# EAGLE design encore Main Board v2 (EAGLE 9.6.2)
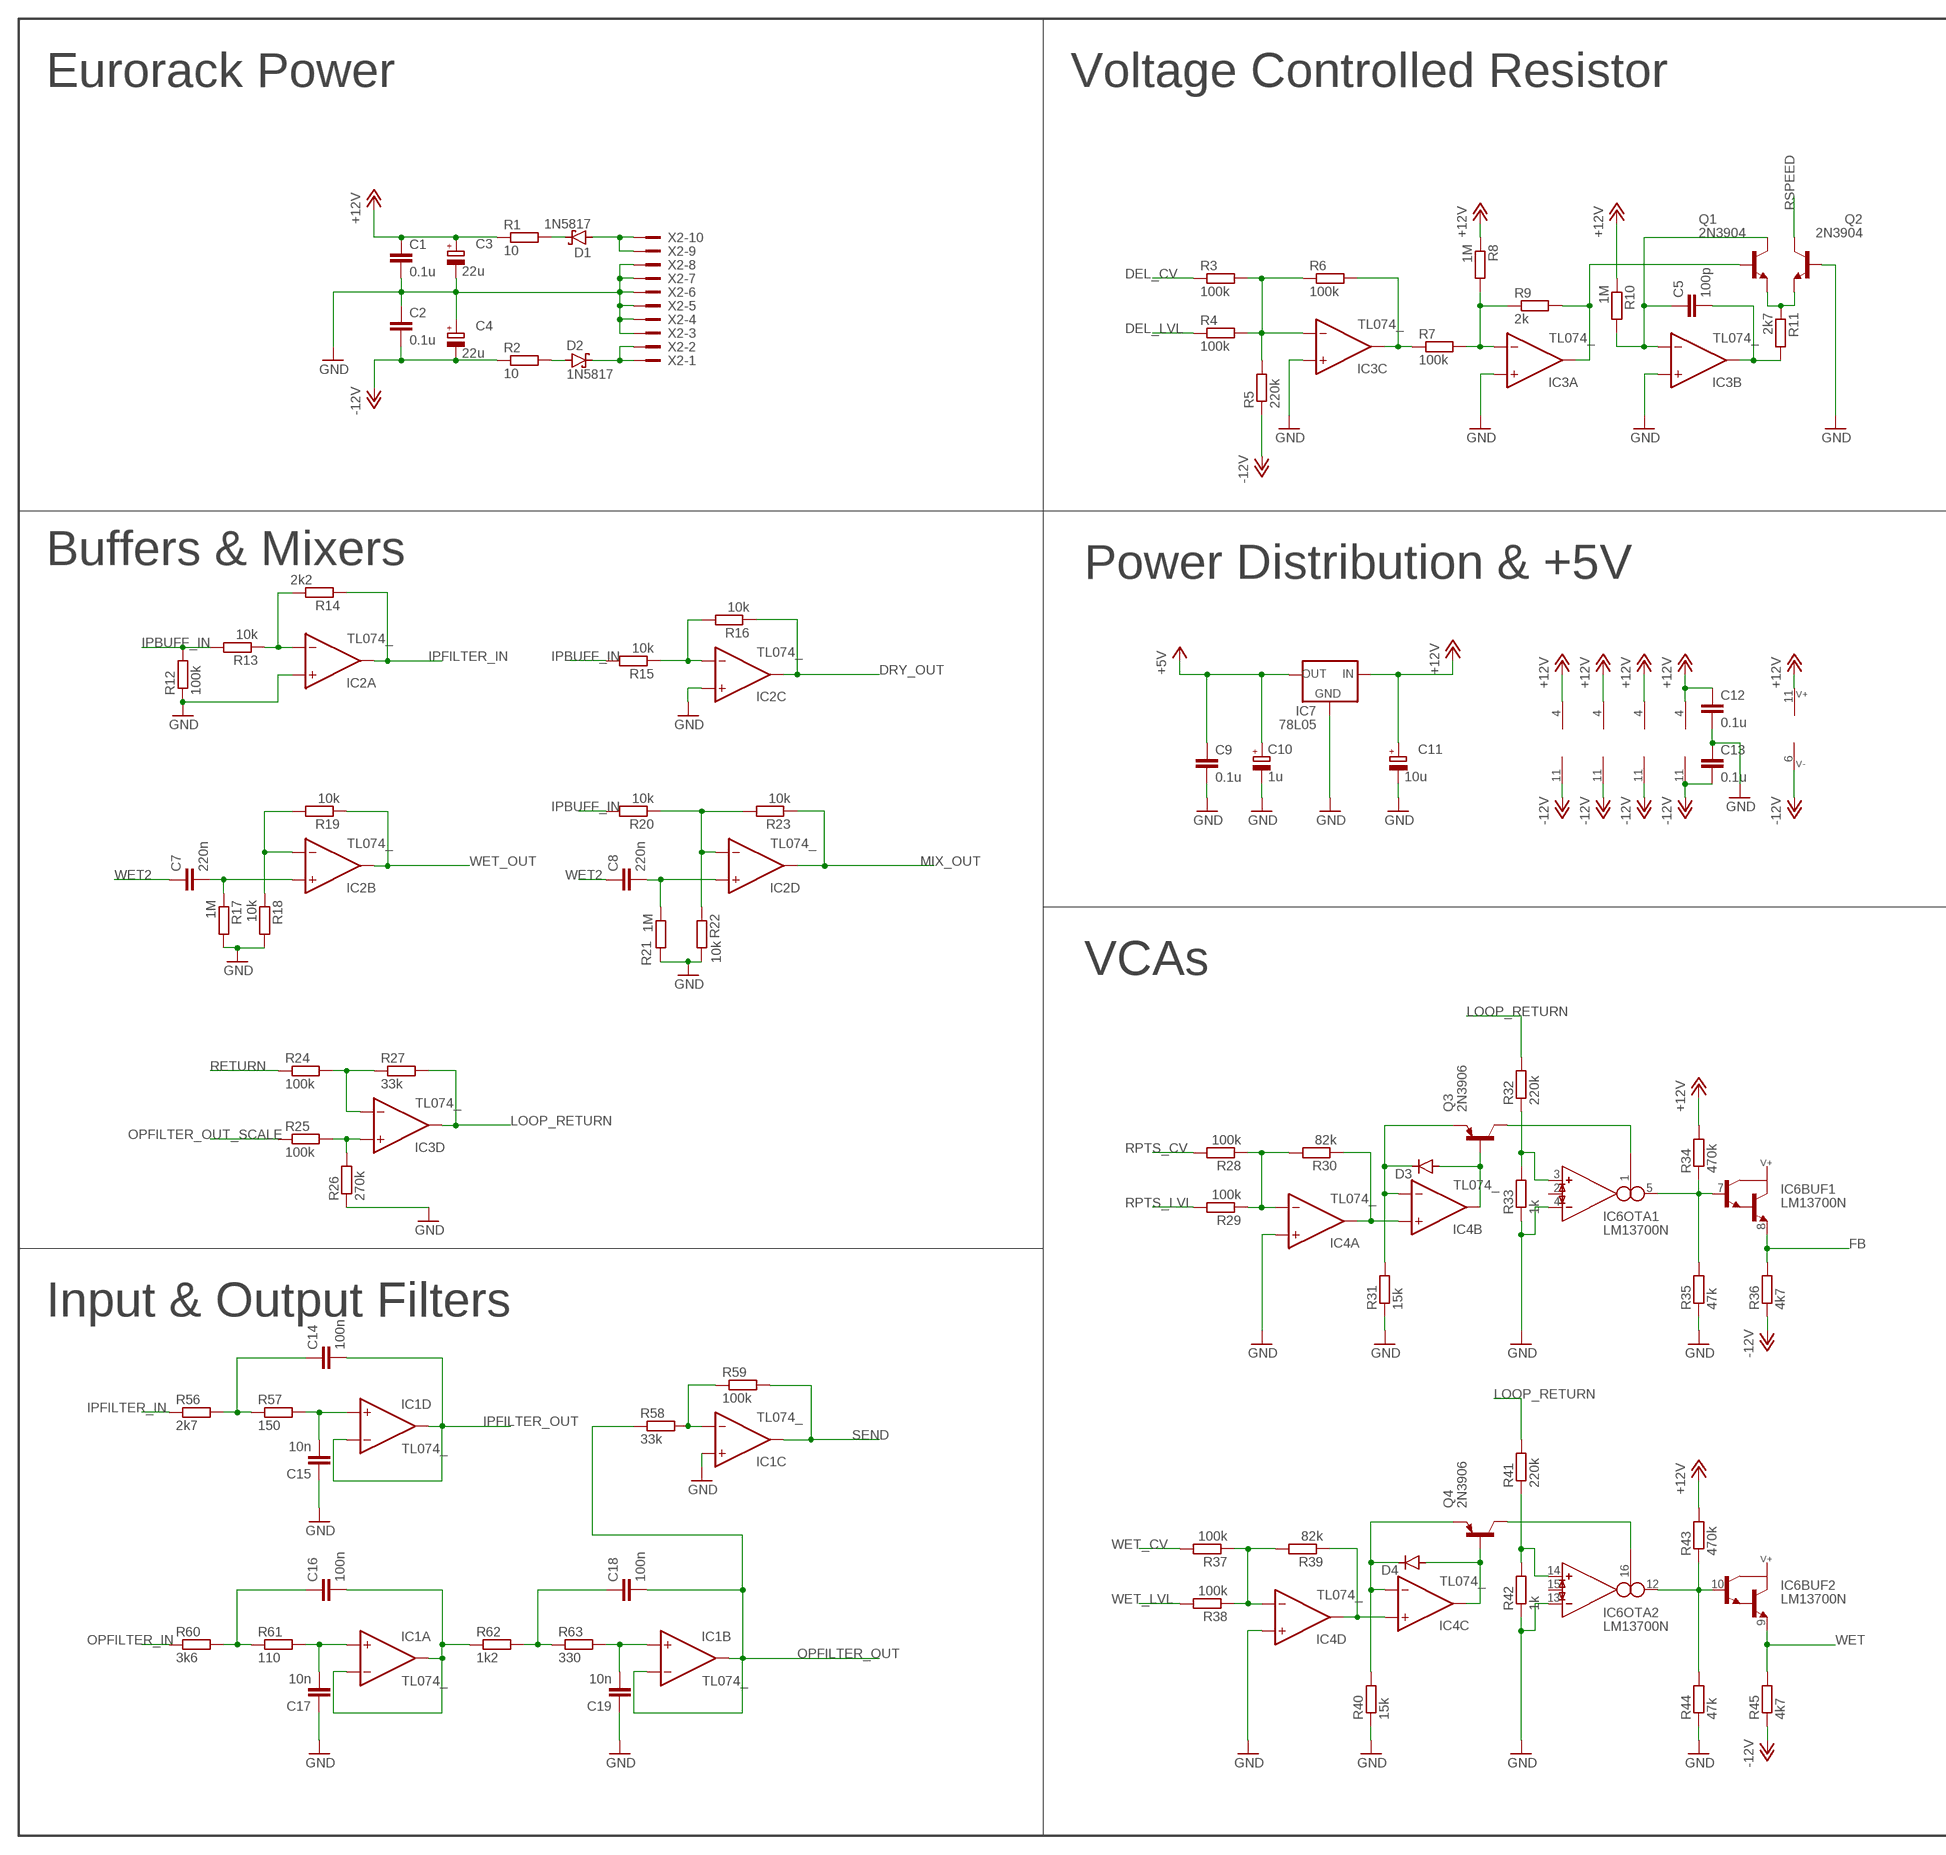
[diagram p0: schematic, sheet 1, part 1 of 2]
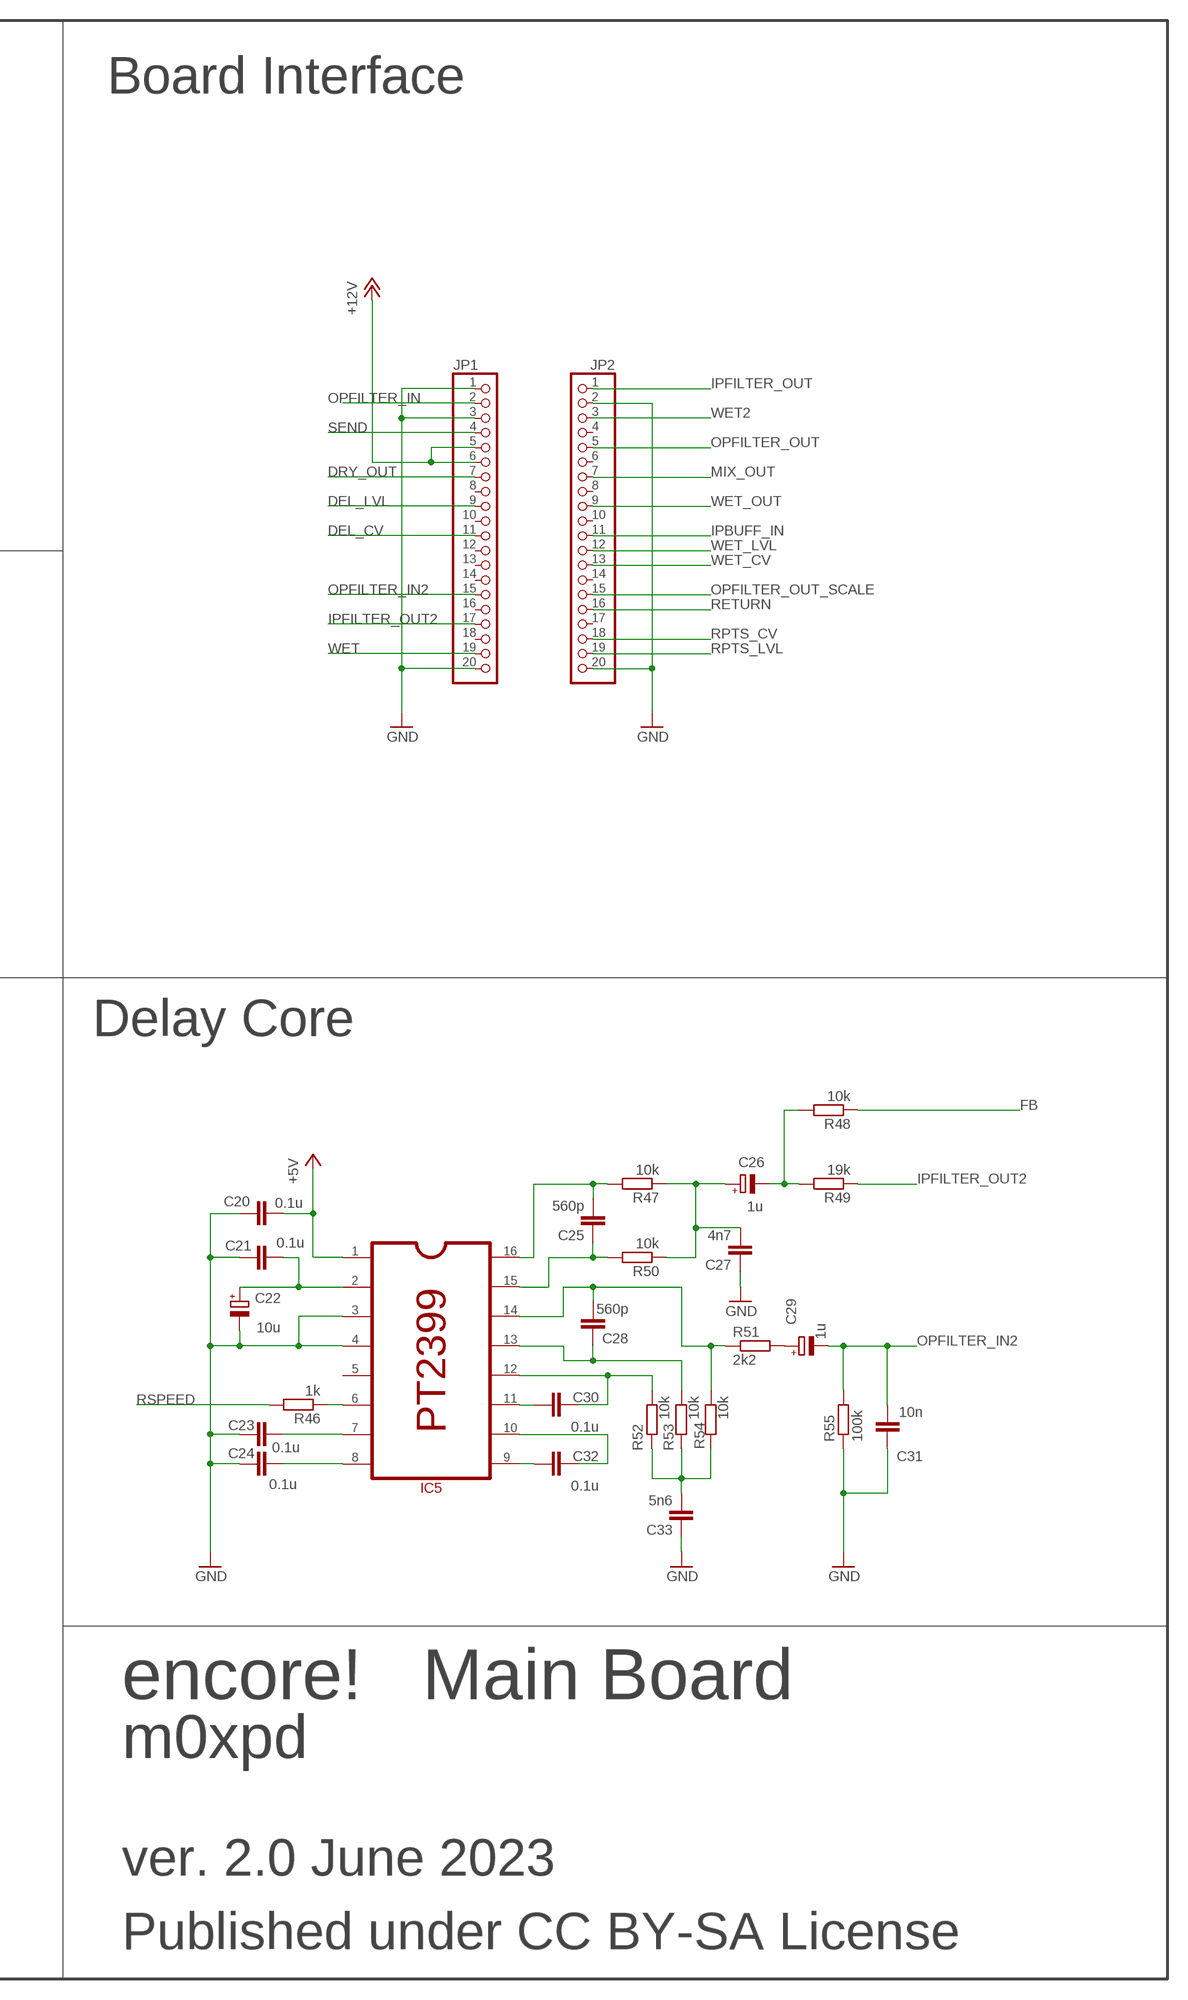
[diagram p1: schematic, sheet 1, part 2 of 2]

## Parts
C1  0.1u  C-EU050-025X075  [C050-025X075]
C2  0.1u  C-EU050-025X075  [C050-025X075]
C3  22u  CPOL-EUE2.5-5  [E2,5-5]
C4  22u  CPOL-EUE2.5-5  [E2,5-5]
C5  100p  C-EU025-025X050  [C025-025X050]
C7  220n  C-EU050-024X044  [C050-024X044]
C8  220n  C-EU050-024X044  [C050-024X044]
C9  0.1u  C-EU050-025X075  [C050-025X075]
C10  1u  CPOL-EUE2.5-5  [E2,5-5]
C11  10u  CPOL-EUE2.5-5  [E2,5-5]
C12  0.1u  C-EU050-025X075  [C050-025X075]
C13  0.1u  C-EU050-025X075  [C050-025X075]
C14  100n  C-EU025-025X050  [C025-025X050]
C15  10n  C-EU025-025X050  [C025-025X050]
C16  100n  C-EU025-025X050  [C025-025X050]
C17  10n  C-EU025-025X050  [C025-025X050]
C18  100n  C-EU025-025X050  [C025-025X050]
C19  10n  C-EU025-025X050  [C025-025X050]
C20  0.1u  C-EU050-025X075  [C050-025X075]
C21  0.1u  C-EU050-025X075  [C050-025X075]
C22  10u  CPOL-EUE2.5-5  [E2,5-5]
C23  0.1u  C-EU050-025X075  [C050-025X075]
C24  0.1u  C-EU050-025X075  [C050-025X075]
C25  560p  C-EU025-025X050  [C025-025X050]
C26  1u  CPOL-EUE2.5-5  [E2,5-5]
C27  4n7  C-EU050-025X075  [C050-025X075]
C28  560p  C-EU025-025X050  [C025-025X050]
C29  1u  CPOL-EUE2.5-5  [E2,5-5]
C30  0.1u  C-EU050-025X075  [C050-025X075]
C31  10n  C-EU025-025X050  [C025-025X050]
C32  0.1u  C-EU050-025X075  [C050-025X075]
C33  5n6  C-EU050-025X075  [C050-025X075]
D1  1N5817  SCHOTTKY-DIODEDO35-7  [DO35-7]
D2  1N5817  SCHOTTKY-DIODEDO35-7  [DO35-7]
D3  1N4148DO35-7  [DO35-7]
D4  1N4148DO35-7  [DO35-7]
IC1  TL074_  [DIL14]
IC2  TL074_  [DIL14]
IC3  TL074_  [DIL14]
IC4  TL074_  [DIL14]
IC5  PT2399  [DIP-16]
IC6  LM13700N  [DIL16]
IC7  78L05  78LXX  [78LXX]
JP1  PINHD-1X20  [1X20]
JP2  PINHD-1X20  [1X20]
Q1  2N3904  [TO92]
Q2  2N3904  [TO92]
Q3  2N3906  [TO92]
Q4  2N3906  [TO92]
R1  10  R-EU_0204/7  [0204/7]
R2  10  R-EU_0204/7  [0204/7]
R3  100k  R-EU_0204/7  [0204/7]
R4  100k  R-EU_0204/7  [0204/7]
R5  220k  R-EU_0204/7  [0204/7]
R6  100k  R-EU_0204/7  [0204/7]
R7  100k  R-EU_0204/7  [0204/7]
R8  1M  R-EU_0204/7  [0204/7]
R9  2k  R-EU_0204/7  [0204/7]
R10  1M  R-EU_0204/7  [0204/7]
R11  2k7  R-EU_0204/7  [0204/7]
R12  100k  R-EU_0204/7  [0204/7]
R13  10k  R-EU_0204/7  [0204/7]
R14  2k2  R-EU_0204/7  [0204/7]
R15  10k  R-EU_0204/7  [0204/7]
R16  10k  R-EU_0204/7  [0204/7]
R17  1M  R-EU_0204/7  [0204/7]
R18  10k  R-EU_0204/7  [0204/7]
R19  10k  R-EU_0204/7  [0204/7]
R20  10k  R-EU_0204/7  [0204/7]
R21  1M  R-EU_0204/7  [0204/7]
R22  10k  R-EU_0204/7  [0204/7]
R23  10k  R-EU_0204/7  [0204/7]
R24  100k  R-EU_0204/7  [0204/7]
R25  100k  R-EU_0204/7  [0204/7]
R26  270k  R-EU_0204/7  [0204/7]
R27  33k  R-EU_0204/7  [0204/7]
R28  100k  R-EU_0204/7  [0204/7]
R29  100k  R-EU_0204/7  [0204/7]
R30  82k  R-EU_0204/7  [0204/7]
R31  15k  R-EU_0204/7  [0204/7]
R32  220k  R-EU_0204/7  [0204/7]
R33  1k  R-EU_0204/7  [0204/7]
R34  470k  R-EU_0204/7  [0204/7]
R35  47k  R-EU_0204/7  [0204/7]
R36  4k7  R-EU_0204/7  [0204/7]
R37  100k  R-EU_0204/7  [0204/7]
R38  100k  R-EU_0204/7  [0204/7]
R39  82k  R-EU_0204/7  [0204/7]
R40  15k  R-EU_0204/7  [0204/7]
R41  220k  R-EU_0204/7  [0204/7]
R42  1k  R-EU_0204/7  [0204/7]
R43  470k  R-EU_0204/7  [0204/7]
R44  47k  R-EU_0204/7  [0204/7]
R45  4k7  R-EU_0204/7  [0204/7]
R46  1k  R-EU_0204/7  [0204/7]
R47  10k  R-EU_0204/7  [0204/7]
R48  10k  R-EU_0204/7  [0204/7]
R49  19k  R-EU_0204/7  [0204/7]
R50  10k  R-EU_0204/7  [0204/7]
R51  2k2  R-EU_0204/7  [0204/7]
R52  10k  R-EU_0204/7  [0204/7]
R53  10k  R-EU_0204/7  [0204/7]
R54  10k  R-EU_0204/7  [0204/7]
R55  100k  R-EU_0204/7  [0204/7]
R56  2k7  R-EU_0204/7  [0204/7]
R57  150  R-EU_0204/7  [0204/7]
R58  33k  R-EU_0204/7  [0204/7]
R59  100k  R-EU_0204/7  [0204/7]
R60  3k6  R-EU_0204/7  [0204/7]
R61  110  R-EU_0204/7  [0204/7]
R62  1k2  R-EU_0204/7  [0204/7]
R63  330  R-EU_0204/7  [0204/7]
X2  2510-  [PAK100/2500-10]

## Nets
+5V: C9.1 C10.+ C20.2 IC5.1 IC7.OUT
+12V: C1.1 C3.+ C11.+ C12.1 IC1.4(P:V+) IC2.4(P:V+) IC3.4(P:V+) IC4.4(P:V+) IC6.11(SUPPLY:V+) IC7.IN JP1.5 JP1.6 R1.1 R8.1 R10.1 R34.2 R43.2
-12V: C2.2 C4.- C13.2 IC1.11(P:V-) IC2.11(P:V-) IC3.11(P:V-) IC4.11(P:V-) IC6.6(SUPPLY:V-) R2.1 R5.1 R36.1 R45.1
DEL_CV: JP1.11 R3.1
DEL_LVL: JP1.9 R4.1
DRY_OUT: IC2.8(C:OUT) JP1.7 R16.1
FB: IC6.8(BUF1:E) R36.2 R48.1
GND: C1.2 C2.1 C3.- C4.+ C9.2 C10.- C11.- C12.2 C13.1 C15.1 C17.1 C19.1 C20.1 C21.1 C22.- C23.1 C24.1 C27.1 C31.1 C33.1 IC1.10(C:+IN) IC2.3(A:+IN) IC2.10(C:+IN) IC3.3(A:+IN) IC3.5(B:+IN) IC3.10(C:+IN) IC4.3(A:+IN) IC4.12(D:+IN) IC5.3 IC5.4 IC6.4(OTA1:IN_N) IC6.13(OTA2:IN_N) IC7.GND JP1.1 JP1.3 JP1.20 JP2.2 JP2.20 Q2.2(B) R12.1 R17.2 R18.2 R21.2 R22.2 R26.1 R31.1 R33.1 R35.1 R40.1 R42.1 R44.1 R55.1 X2.3 X2.4 X2.5 X2.6 X2.7 X2.8
IPBUFF_IN: JP2.11 R12.2 R13.2 R15.2 R20.2
IPFILTER_IN: IC2.1(A:OUT) R14.1 R56.1
IPFILTER_OUT: C14.2 IC1.13(D:-IN) IC1.14(D:OUT) JP2.1
IPFILTER_OUT2: JP1.17 R49.1
LOOP_RETURN: IC3.14(D:OUT) R27.2 R32.2 R41.2
MIX_OUT: IC2.14(D:OUT) JP2.7 R23.1
N$1: IC3.1(A:OUT) Q1.2(B) R9.2
N$2: C15.2 IC1.12(D:+IN) R57.2
N$3: C5.1 IC3.6(B:-IN) Q1.1(C) R10.2
N$4: C14.1 R56.2 R57.1
N$5: C16.2 IC1.1(A:OUT) IC1.2(A:-IN) R62.1
N$6: C16.1 R60.2 R61.1
N$7: C17.2 IC1.3(A:+IN) R61.2
N$8: C5.2 IC3.7(B:OUT) R11.2
N$9: Q1.3(E) Q2.3(E) R11.1
N$10: C18.1 R62.2 R63.1
N$11: C19.2 IC1.5(B:+IN) R63.2
N$12: IC2.2(A:-IN) R13.1 R14.2
N$13: D1.A X2.9 X2.10
N$14: D1.C R1.2
N$15: C26.- R48.2 R49.2
N$17: IC2.6(B:-IN) R18.1 R19.2
N$18: C21.2 C22.+ IC5.2
N$19: IC1.9(C:-IN) R58.2 R59.1
N$20: IC6.5(OTA1:OUT) IC6.7(BUF1:B) R34.1 R35.2
N$21: C7.2 IC2.5(B:+IN) R17.1
N$22: IC3.12(D:+IN) R25.2 R26.2
N$23: C32.2 IC5.10
N$24: IC6.3(OTA1:IN_P) R32.1 R33.2
N$25: D3.A IC4.7(B:OUT) Q3.2(B)
N$26: D3.C IC4.6(B:-IN) Q3.3(E) R31.2
N$27: D2.A R2.2
N$28: D2.C X2.1 X2.2
N$29: IC6.1(OTA1:I_BIAS) Q3.1(C)
N$30: IC4.1(A:OUT) IC4.5(B:+IN) R30.1
N$31: IC5.6 R46.1
N$33: IC4.2(A:-IN) R28.1 R29.1 R30.2
N$35: IC4.10(C:+IN) IC4.14(D:OUT) R39.1
N$36: IC6.10(BUF2:B) IC6.12(OTA2:OUT) R43.1 R44.2
N$38: IC6.16(OTA2:I_BIAS) Q4.1(C)
N$39: IC6.14(OTA2:IN_P) R41.1 R42.2
N$40: D4.C IC4.9(C:-IN) Q4.3(E) R40.2
N$41: D4.A IC4.8(C:OUT) Q4.2(B)
N$42: IC3.2(A:-IN) R7.2 R8.2 R9.1
N$43: IC4.13(D:-IN) R37.1 R38.1 R39.2
N$46: IC3.8(C:OUT) R6.2 R7.1
N$47: C23.2 IC5.7
N$48: IC3.9(C:-IN) R3.2 R4.2 R5.2 R6.1
N$49: C24.2 IC5.8
N$50: C25.2 IC5.16 R47.2
N$52: C25.1 IC5.15 R50.2
N$53: C26.+ C27.2 R47.1 R50.1
N$54: C32.1 IC5.9
N$55: C28.2 IC5.14 R51.1 R54.1
N$56: C28.1 IC5.13 R53.1
N$57: C30.1 IC5.11
N$58: C30.2 IC5.12 R52.1
N$59: C33.2 R52.2 R53.2 R54.2
N$60: C29.+ R51.2
N$61: C8.2 IC2.12(D:+IN) R21.1
N$62: IC2.13(D:-IN) R20.1 R22.1 R23.2
N$65: IC3.13(D:-IN) R24.2 R27.1
N$66: IC2.9(C:-IN) R15.1 R16.2
OPFILTER_IN: JP1.2 R60.1
OPFILTER_IN2: C29.- C31.2 JP1.15 R55.2
OPFILTER_OUT: C18.2 IC1.6(B:-IN) IC1.7(B:OUT) JP2.5 R58.1
OPFILTER_OUT_SCALE: JP2.15 R25.1
RETURN: JP2.16 R24.1
RPTS_CV: JP2.18 R28.2
RPTS_LVL: JP2.19 R29.2
RSPEED: Q2.1(C) R46.2
SEND: IC1.8(C:OUT) JP1.4 R59.2
WET: IC6.9(BUF2:E) JP1.19 R45.2
WET2: C7.1 C8.1 JP2.3
WET_CV: JP2.13 R37.2
WET_LVL: JP2.12 R38.2
WET_OUT: IC2.7(B:OUT) JP2.9 R19.1
Unconnected: IC5.5 IC6.2(OTA1:I_DIODE) IC6.15(OTA2:I_DIODE) JP1.8 JP1.10 JP1.12 JP1.13 JP1.14 JP1.16 JP1.18 JP2.4 JP2.6 JP2.8 JP2.10 JP2.14 JP2.17

## Notes on the sheet
- Eurorack Power | Voltage Controlled Resistor | Board Interface
- Buffers & Mixers | Power Distribution & +5V
- VCAs | Delay Core
- Input & Output Filters
- encore!   Main Board
- m0xpd
- ver. 2.0 June 2023
- Published under CC BY-SA License

## Library data of the parts
C1 C2 C5 C7-C9 C12-C21 C23-C25 C27 C28 C30-C33 = rcl:C-EU: CAPACITOR, European symbol; SPICEPREFIX: C
C3 C4 C10 C11 C22 C26 C29 = rcl:CPOL-EU: POLARIZED CAPACITOR, European symbol; SPICEPREFIX: C
D1 D2 = diode:SCHOTTKY-DIODE: Schottky Diode
D3 D4 = diode:1N4148: DIODE high speed (Philips)
IC1-IC4 = MusicThingModular:TL074: Generic Quad Op Amp
IC5 = ic-princeton-technologies:PT2399
IC6 = ota:LM13700: Dual OTA with buffers
IC7 = v-reg:78LXX: VOLTAGE REGULATOR
JP1 JP2 = pinhead:PINHD-1X20: PIN HEADER
Q1 Q2 = transistor-npn:2N3904: NPN Transistor
Q3 Q4 = transistor-pnp:2N3906: PNP Transistor
R1-R63 = rcl:R-EU_: RESISTOR, European symbol; SPICEPREFIX: R
X2 = con-3m:2510-: 3M (TM) Pak 100 4-Wall Header Source: 3M; MF: 3M; MPN: 2510-6002UB; OC_FARNELL: 9838244; OC_NEWARK: 46F4725

## Board
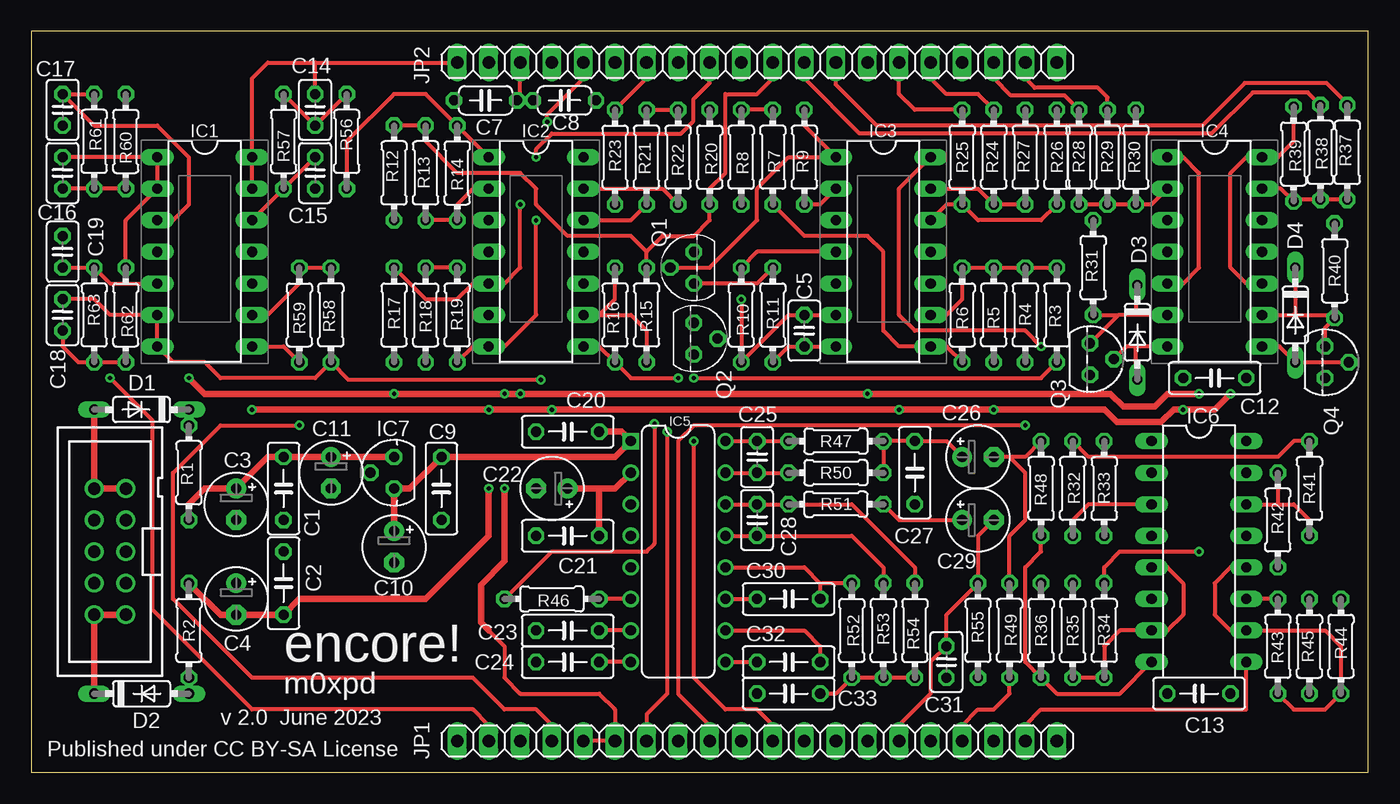
[diagram p2: board, top side]
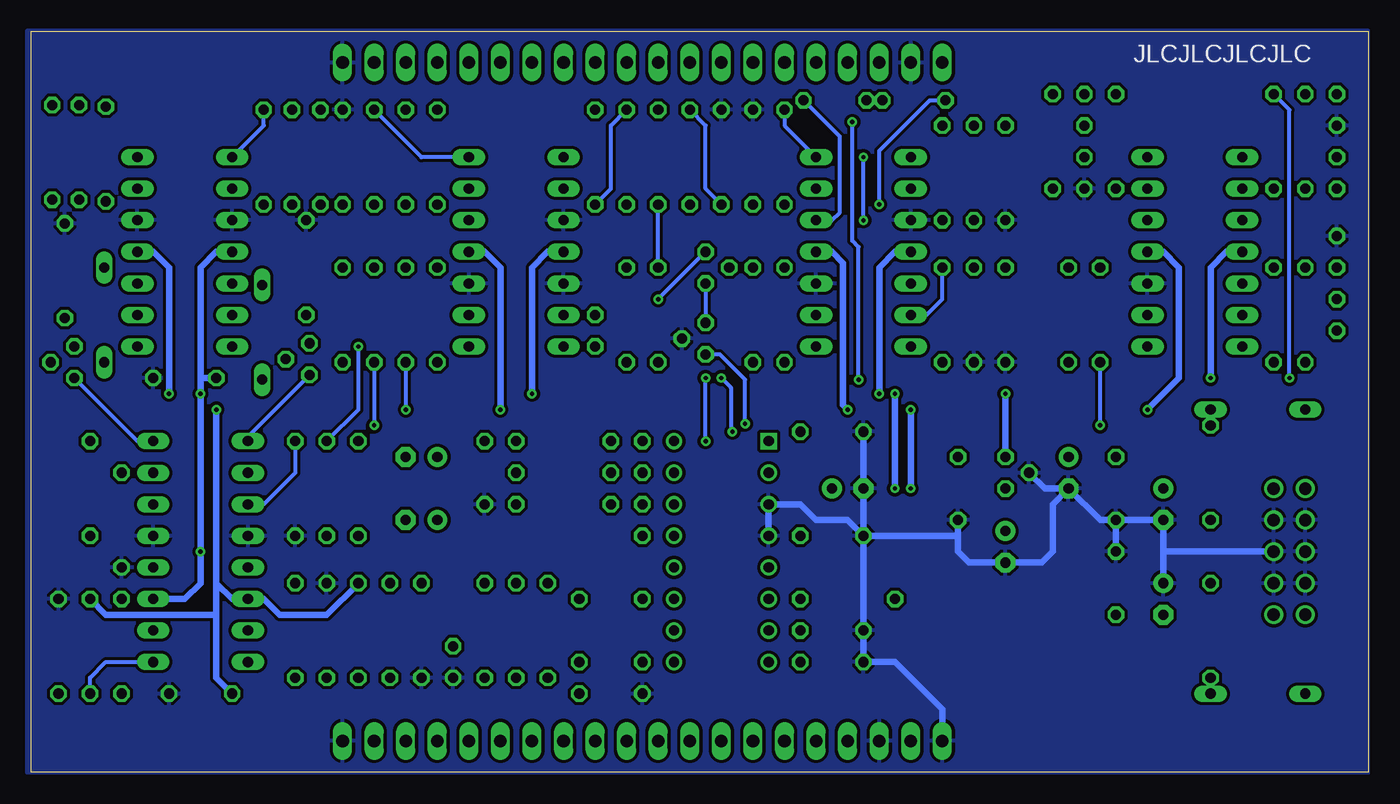
[diagram p3: board, bottom side, seen from below]

Size 107.62 x 59.68 mm. Coordinates in mm from the lower left corner, seen from the top.
Outline: 0,0 107.62,0 107.62,59.68 0,59.68 0,0
Copper layers (1*16): Top 0.035mm / dielectric 1.5mm / Bottom 0.035mm
Design rules "default *": minimum track width 6mil, minimum drill 0.35mm, track to track 10mil, track to pad 10mil, pad to pad 6mil, via to via 6mil, smd to smd 6mil, copper to edge 0mil, drill to drill 6mil, minimum pad ring 10mil, minimum via ring 8mil, stop-mask expansion 4mil, vias tented up to drill 0mil, thermal gap 10mil

### Footprints (pad centres in the part's own frame; a part is rotated, then mirrored left to right if it is on the bottom)
C050-025X075 = drill 0.813 octagon: 1 -2.54,0; 2 2.54,0
E2,5-5 = drill 0.813 pad 1.6: + -1.27,0 | drill 0.813 pad 1.6 octagon: - 1.27,0
C025-025X050 = drill 0.813 octagon: 1 -1.27,0; 2 1.27,0
C050-024X044 = drill 0.813 octagon: 1 -2.54,0; 2 2.54,0
DO35-7 = drill 0.813 long: A 3.81,0; C -3.81,0
DIL14 = drill 0.813 long: 1 -7.62,-3.81; 2 -5.08,-3.81; 3 -2.54,-3.81; 4 0,-3.81; 5 2.54,-3.81; 6 5.08,-3.81; 7 7.62,-3.81; 8 7.62,3.81; 9 5.08,3.81; 10 2.54,3.81; 11 0,3.81; 12 -2.54,3.81; 13 -5.08,3.81; 14 -7.62,3.81
DIP-16 = drill 0.813 square: 1 -8.89,-3.81 | drill 0.813: 2 -6.35,-3.81; 3 -3.81,-3.81; 4 -1.27,-3.81; 5 1.27,-3.81; 6 3.81,-3.81; 7 6.35,-3.81; 8 8.89,-3.81; 9 8.89,3.81; 10 6.35,3.81; 11 3.81,3.81; 12 1.27,3.81; 13 -1.27,3.81; 14 -3.81,3.81; 15 -6.35,3.81; 16 -8.89,3.81
DIL16 = drill 0.813 long: 1 -8.89,-3.81; 2 -6.35,-3.81; 3 -3.81,-3.81; 4 -1.27,-3.81; 5 1.27,-3.81; 6 3.81,-3.81; 7 6.35,-3.81; 8 8.89,-3.81; 9 8.89,3.81; 10 6.35,3.81; 11 3.81,3.81; 12 1.27,3.81; 13 -1.27,3.81; 14 -3.81,3.81; 15 -6.35,3.81; 16 -8.89,3.81
78LXX = drill 0.813 octagon: GND 0,1.905; IN 1.27,0; OUT -1.27,0
1X20 = drill 1.016 long: 1 -24.13,0; 2 -21.59,0; 3 -19.05,0; 4 -16.51,0; 5 -13.97,0; 6 -11.43,0; 7 -8.89,0; 8 -6.35,0; 9 -3.81,0; 10 -1.27,0; 11 1.27,0; 12 3.81,0; 13 6.35,0; 14 8.89,0; 15 11.43,0; 16 13.97,0; 17 16.51,0; 18 19.05,0; 19 21.59,0; 20 24.13,0
TO92 = drill 0.813 octagon: 1 1.27,0; 2 0,1.905; 3 -1.27,0
0204/7 = drill 0.813 octagon: 1 -3.81,0; 2 3.81,0
PAK100/2500-10 = drill 1 pad 1.422: 1 -5.08,-1.27; 2 -5.08,1.27; 3 -2.54,-1.27; 4 -2.54,1.27; 5 0,-1.27; 6 0,1.27; 7 2.54,-1.27; 8 2.54,1.27; 9 5.08,-1.27; 10 5.08,1.27

### Placement (x,y rotation side)
C1  20.32,22.86 270 top
C2  20.32,15.24 270 top
C3  16.51,21.59 270 top
C4  16.51,13.97 270 top
C5  62.23,35.56 270 top
C7  36.58,54.1 180 top
C8  42.93,54.1 0 top
C9  33.02,22.86 270 top
C10  29.21,18.16 270 top
C11  24.13,24.13 270 top
C12  95.25,31.75 0 top
C13  93.98,6.35 180 top
C14  22.86,53.34 90 top
C15  22.86,48.26 90 top
C16  2.54,48.26 90 top
C17  2.54,53.34 90 top
C18  2.54,36.83 90 top
C19  2.54,41.91 270 top
C20  43.18,27.43 0 top
C21  43.18,19.05 0 top
C22  41.91,22.86 180 top
C23  43.18,11.43 0 top
C24  43.18,8.89 0 top
C25  58.42,25.4 90 top
C26  76.2,25.4 0 top
C27  71.12,24.13 90 top
C28  58.42,20.32 90 top
C29  76.2,20.32 0 top
C30  60.96,13.97 0 top
C31  73.66,8.89 90 top
C32  60.96,8.89 0 top
C33  60.96,6.35 0 top
D1  8.89,29.21 180 top
D2  8.89,6.35 0 top
D3  89.03,35.43 270 top
D4  101.73,36.83 270 top
IC1  13.97,41.91 270 top
IC2  40.64,41.91 270 top
IC3  68.58,41.91 270 top
IC4  95.25,41.91 270 top
IC5  52.07,17.78 270 top
IC6  93.98,17.78 270 top
IC7  29.21,24.13 90 top
JP1  58.42,2.54 0 top
JP2  58.42,57.15 0 top
Q1  53.34,40.64 90 top
Q2  53.34,34.92 270 top
Q3  85.22,33.27 270 top
Q4  104.14,33.02 270 top
R1  12.7,24.13 90 top
R2  12.7,11.43 270 top
R3  82.55,36.83 90 top
R4  80.01,36.83 90 top
R5  77.47,36.83 90 top
R6  74.93,36.83 270 top
R7  59.69,49.53 90 top
R8  57.15,49.53 90 top
R9  62.23,49.53 90 top
R10  57.15,36.83 270 top
R11  59.69,36.83 270 top
R12  29.21,48.26 90 top
R13  31.75,48.26 90 top
R14  34.29,48.26 270 top
R15  49.53,36.83 90 top
R16  46.99,36.83 90 top
R17  29.21,36.83 270 top
R18  31.75,36.83 270 top
R19  34.29,36.83 90 top
R20  54.61,49.53 270 top
R21  49.53,49.53 90 top
R22  52.07,49.53 90 top
R23  46.99,49.53 270 top
R24  77.47,49.53 270 top
R25  74.93,49.53 270 top
R26  82.55,49.53 270 top
R27  80.01,49.53 90 top
R28  84.33,49.53 90 top
R29  86.61,49.53 90 top
R30  88.9,49.53 270 top
R31  85.47,40.64 270 top
R32  83.82,22.86 90 top
R33  86.36,22.86 90 top
R34  86.36,11.43 90 top
R35  83.82,11.43 270 top
R36  81.28,11.43 270 top
R37  105.92,49.91 90 top
R38  103.76,49.91 90 top
R39  101.6,49.78 270 top
R40  104.9,40.39 270 top
R41  102.87,22.86 90 top
R42  100.33,20.32 90 top
R43  100.33,10.16 90 top
R44  105.41,10.16 270 top
R45  102.87,10.16 270 top
R46  41.91,13.97 180 top
R47  64.77,26.67 180 top
R48  81.28,22.86 90 top
R49  78.74,11.43 90 top
R50  64.77,24.13 180 top
R51  64.77,21.59 0 top
R52  66.04,11.43 270 top
R53  68.58,11.43 270 top
R54  71.12,11.43 270 top
R55  76.2,11.43 90 top
R56  25.4,50.8 90 top
R57  20.32,50.8 270 top
R58  24.13,36.83 90 top
R59  21.59,36.83 270 top
R60  7.62,50.8 270 top
R61  5.08,50.8 90 top
R62  7.62,36.83 270 top
R63  5.08,36.83 90 top
X2  6.35,17.78 90 top

### Tracks (layer width: path | path; a pad name or v marks a point on that pad's centre or on a via)
+5V
  Top 0.508: C10.+ IC7.OUT 30.48,22.86 C9.1 46.99,25.4 IC5.1 47.5,27.43 C20.2
+12V  (via drill 0.35)
  Top 0.305: R43.2 IC6.11 | R34.2 86.36,16.51 87.63,17.78 v93.98,17.78 | IC3.4 58.42,41.91 R10.1 | 36.83,11.43 38.1,10.16 38.1,7.62 39.37,6.35 45.72,6.35 46.99,5.08 JP1.6 JP1.5
  Top 0.508: R1.1 12.7,21.59 13.97,22.86 C3.+ 19.05,25.4 C1.1 C11.+ IC7.IN | v93.98,30.48 91.44,30.48 90.42,29.46 87.88,29.46 86.87,30.48 v67.31,30.48 v39.37,30.48 v38.1,30.48 v29.21,30.48 13.97,30.48 v12.7,31.75 | 36.83,11.43 36.2,12.06 36.2,15.11 38.1,17.02 v38.1,22.86
  Bottom 0.305: R10.1 R8.1
  Bottom 0.508: IC7.IN v29.21,30.48 | v12.7,31.75 12.7,40.64 11.43,41.91 IC1.4 | IC2.4 38.1,41.91 39.37,40.64 v39.37,30.48 | IC3.4 66.04,41.91 67.31,40.64 v67.31,30.48 | IC4.4 92.71,41.91 93.98,40.64 93.98,31.75 | 93.98,31.75 v93.98,30.48 v93.98,17.78 93.98,15.24 95.25,13.97 IC6.11 | v38.1,22.86 v38.1,30.48 | C12.1 93.98,31.75
-12V  (via drill 0.35)
  Top 0.508: R2.1 15.24,12.7 C4.- C2.2 21.59,13.97 31.75,13.97 36.83,19.05 v36.83,22.86 | v17.78,29.21 v36.83,29.21 v41.91,29.21 v69.85,29.21 v77.47,29.21 86.36,29.21 87.38,28.19 90.93,28.19 91.95,29.21 v92.71,29.21 95.25,29.21 v96.52,30.48
  Bottom 0.305: R5.1 v77.47,29.21
  Bottom 0.508: v36.83,22.86 v36.83,29.21 | v17.78,29.21 15.24,31.75 15.24,40.64 16.51,41.91 IC1.11 | IC2.11 43.18,41.91 42.29,41.02 42.29,29.59 v41.91,29.21 | IC3.11 71.12,41.91 69.85,40.64 v69.85,29.21 | IC4.11 97.79,41.91 96.52,40.64 v96.52,30.48 | 92.71,15.24 91.44,13.97 IC6.6 88.9,13.97 87.63,12.7 83.82,12.7 R36.1 | 92.71,15.24 v92.71,29.21 | C13.2 92.71,7.62 92.71,12.7 | 92.71,12.7 92.71,15.24 | R45.1 101.6,12.7 92.71,12.7
DEL_CV  (via drill 0.35)
  Top 0.305: JP1.11 59.69,3.81 58.42,5.08 55.88,5.08 53.34,7.62 v53.34,26.67 | v53.34,31.75 81.28,31.75 R3.1
  Bottom 0.305: v53.34,26.67 v53.34,31.75
DEL_LVL  (via drill 0.35)
  Top 0.305: v80.01,27.94 53.34,27.94 52.07,26.67 52.07,6.35 54.61,3.81 JP1.9
  Bottom 0.305: R4.1 v80.01,27.94
DRY_OUT  (via drill 0.35)
  Top 0.305: IC2.8 45.72,34.29 R16.1 48.26,31.75 v52.07,31.75 | v51.18,27.43 51.18,6.35 49.53,4.7 JP1.7
  Bottom 0.305: v52.07,31.75 51.31,30.99 51.31,27.56 v51.18,27.43
FB
  Top 0.305: IC6.8 87.63,6.35 82.55,6.35 R36.2 80.01,8.89 80.01,16.51 81.28,17.78 R48.1
GND
  Top 0.305: R21.2 R22.2
  Bottom 0.508: C20.1 C22.- C21.1 | IC5.4 IC5.3 45.72,21.59 44.45,20.32 41.91,20.32 C21.1 | 16.51,17.78 C3.- C1.2 | 16.51,17.78 C4.+ | C1.2 C2.1 | C11.- 21.59,20.32 C1.2 | IC7.GND 26.04,22.86 C11.- | C11.- 25.4,21.59 25.4,17.78 26.29,16.89 C10.- 32.13,16.89 33.02,17.78 33.02,19.05 | 33.02,19.05 C9.2 | C21.1 33.02,19.05 | C21.1 C23.1 C24.1 38.1,8.89 34.29,5.08 JP1.1 | X2.5 16.51,17.78
  pour Bottom: 0,0 0,59.69 107.95,59.69 107.95,0
IPBUFF_IN
  Top 0.305: R12.2 R13.2 31.75,50.8 34.29,48.26 39.37,48.26 40.64,46.99 40.64,45.72 43.18,43.18 48.26,43.18 49.53,41.91 | R15.2 49.53,41.91 | 49.53,41.91 50.8,43.18 53.34,43.18 54.61,44.45 R20.2 54.61,46.99 55.88,48.26 55.88,54.61 58.42,54.61 59.69,55.88 JP2.11
IPFILTER_IN
  Top 0.305: IC2.1 R14.1 31.75,54.61 29.21,54.61 25.4,50.8 R56.1
IPFILTER_OUT
  Top 0.305: IC1.13 IC1.14 17.78,55.88 19.05,57.15 22.86,57.15 | 22.86,57.15 JP2.1 | C14.2 22.86,57.15
IPFILTER_OUT2
  Top 0.305: JP1.17 74.93,3.81 76.2,5.08 77.47,5.08 78.74,6.35 R49.1
LOOP_RETURN  (via drill 0.35)
  Top 0.305: R41.2 101.6,26.67 100.33,25.4 85.09,25.4 R32.2 | v81.28,34.29 80.01,35.56 71.12,35.56 69.85,36.83 69.85,46.99 IC3.14
  Bottom 0.305: IC3.14 76.2,49.53 R27.2 | R32.2 81.28,29.21 v81.28,34.29
MIX_OUT
  Top 0.305: R23.1 49.53,55.88 JP2.7
  Bottom 0.305: R23.1 46.99,52.07 IC2.14
N$1
  Top 0.305: R9.2 62.23,52.07 IC3.1 60.96,49.53 58.42,46.99 58.42,44.45 54.61,40.64 Q1.2
N$2
  Top 0.305: IC1.12 R57.2 C15.2
N$3  (via drill 0.35)
  Top 0.305: IC3.6 C5.1 60.96,36.83 R10.2 v57.15,38.1
  Bottom 0.305: Q1.1 v57.15,38.1
N$4
  Top 0.305: R57.1 C14.1 R56.2
N$5
  Top 0.305: C16.2 IC1.1 IC1.2 7.62,44.45 R62.1
N$6
  Top 0.305: R60.2 R61.1 C16.1
N$7
  Top 0.305: R61.2 C17.2 5.08,52.07 10.16,52.07 12.7,49.53 12.7,45.72 11.43,44.45 IC1.3
N$8
  Top 0.305: R11.2 60.96,34.29 C5.2 IC3.7
N$9
  Top 0.305: R11.1 58.42,39.37 Q1.3
  Bottom 0.305: Q1.3 Q2.3
N$10
  Top 0.305: C18.1 2.54,34.29 3.81,33.02 R63.1 R62.2
N$11
  Top 0.305: C19.2 R63.2 6.35,39.37 IC1.5
N$12
  Top 0.305: IC2.2 35.56,46.99 34.29,45.72 R14.2 R13.1
N$13
  Top 0.508: X2.9 X2.10 D1.A
N$14
  Top 0.508: D1.C R1.2
N$15
  Top 0.305: R49.2 78.74,19.05 80.01,20.32 80.01,24.13 78.74,25.4 | 78.74,25.4 C26.- | R48.2 80.01,25.4 78.74,25.4
N$17
  Top 0.305: R19.2 R18.1
  Bottom 0.305: IC2.6 35.56,36.83 34.29,38.1 R19.2
N$18
  Top 0.508: IC5.2 46.99,22.86 45.72,22.86 | 45.72,22.86 C22.+ | C21.2 45.72,22.86
N$19
  Top 0.305: IC1.9 19.05,36.83 21.59,39.37 R59.1 R58.2
N$20
  Top 0.305: IC6.5 91.44,16.51 92.71,15.24 92.71,12.7 91.44,11.43 IC6.7 87.63,11.43 86.36,10.16 R34.1 R35.2
N$21  (via drill 0.35)
  Top 0.305: R17.1 31.75,38.1 34.29,38.1 35.56,39.37 IC2.5 38.1,39.37 39.37,40.64 v39.37,45.72
  Bottom 0.305: v39.37,45.72 39.37,50.04 35.31,54.1 C7.2
N$22
  Top 0.305: IC3.12 73.66,45.72 R25.2 76.2,44.45 81.28,44.45 R26.2
N$23
  Top 0.305: IC5.10 62.23,11.43 63.5,10.16 C32.2
N$24
  Top 0.305: IC6.3 85.09,21.59 83.82,20.32 R32.1
  Bottom 0.305: R33.2 86.36,24.13 88.9,21.59 IC6.3
N$25
  Top 0.305: Q3.2 88.14,34.29 88.9,34.29 | IC4.7 88.9,34.29 | D3.A 88.9,31.75 88.9,34.29
N$26
  Top 0.305: 87.5,36.83 Q3.3 | IC4.6 88.9,36.83 | 88.9,36.83 87.5,36.83 | D3.C 88.9,39.12 88.9,36.83 | R31.2 87.5,36.83
N$27
  Top 0.508: D2.A R2.2
N$28
  Top 0.508: X2.1 X2.2 D2.C
N$29
  Bottom 0.305: Q3.1 90.17,27.05 IC6.1
N$30
  Top 0.305: IC4.5 92.71,39.37 93.98,40.64 93.98,48.26 92.71,49.53 IC4.1
  Bottom 0.305: IC4.1 88.9,52.07 R30.1
N$31
  Top 0.305: IC5.6 R46.1
N$33
  Top 0.305: IC4.2 90.17,45.72 R30.2 R29.1 R28.1
N$35
  Top 0.305: R39.1 101.6,50.8 100.33,49.53 IC4.14 97.79,49.53 96.52,48.26 96.52,40.64 97.79,39.37 IC4.10
N$36
  Top 0.305: 97.79,16.41 IC6.12 96.52,16.51 95.25,15.24 95.25,12.7 96.52,11.43 IC6.10 104.14,11.43 105.41,10.16 R44.2 104.14,5.08 101.6,5.08 R43.1
N$38
  Bottom 0.305: IC6.16 99.06,26.67 Q4.1
N$39
  Top 0.305: IC6.14 100.33,21.59 | 100.33,21.59 101.6,21.59 102.87,20.32 R41.1 | R42.2 100.33,21.59
N$40
  Top 0.305: IC4.9 101.6,36.83 | 101.6,36.83 104.65,36.83 R40.2 104.14,35.81 Q4.3 | D4.C 101.73,36.96 101.6,36.83
N$41
  Top 0.305: IC4.8 100.46,34.29 D4.A Q4.2
N$42
  Top 0.305: IC3.2 63.5,45.72 R9.1 | R7.2 R8.2
  Bottom 0.305: R9.1 60.96,46.99 60.96,52.07 R7.2
N$43
  Top 0.305: R38.1 R37.1 101.73,46.1 R39.2 100.58,46.99 IC4.13
N$46
  Top 0.305: R6.2 73.66,34.29 IC3.8 69.85,34.29 68.58,35.56 68.58,41.91 67.31,43.18 62.23,43.18 R7.1
N$47
  Top 0.305: IC5.7 C23.2
N$48
  Top 0.305: IC3.9 73.66,36.83 74.93,38.1 R6.1 R5.2 R4.2 R3.2
N$49
  Top 0.305: IC5.8 C24.2
N$50
  Top 0.305: IC5.16 C25.2 R47.2
N$52
  Top 0.305: IC5.15 C25.1 R50.2
N$53
  Top 0.305: R50.1 R47.1 C27.2 73.66,26.67 C26.+
N$54
  Top 0.305: IC5.9 C32.1
N$55
  Top 0.305: IC5.14 C28.2 R51.1 66.04,21.59 71.12,16.51 R54.1
N$56
  Top 0.305: IC5.13 C28.1 66.04,19.05 68.58,16.51 R53.1
N$57
  Top 0.305: IC5.11 C30.1
N$58
  Top 0.305: IC5.12 62.23,16.51 63.5,15.24 | 63.5,15.24 C30.2 | R52.1 63.5,15.24
N$59
  Top 0.305: R54.2 R53.2 R52.2 64.77,6.35 C33.2
N$60
  Top 0.305: R51.2 69.85,20.32 C29.+
N$61
  Top 0.305: IC2.12 48.26,44.45 R21.1
  Bottom 0.305: IC2.12 43.18,44.45 42.55,45.09 42.55,51.18 C8.2
N$62
  Top 0.305: IC2.13 46.99,46.99 | 46.99,46.99 50.8,46.99 R22.1 | R23.2 46.99,46.99
  Bottom 0.305: R22.1 53.34,46.99 53.34,52.07 R20.1
N$65
  Top 0.305: IC3.13 76.2,46.99 R24.2 R27.1
N$66
  Top 0.305: R16.2 46.99,38.1 45.72,36.83 IC2.9 48.26,36.83 49.53,35.56 R15.1
OPFILTER_IN  (via drill 0.35)
  Top 0.305: v6.35,31.75 9.78,28.32 9.78,13.08 17.78,5.08 35.56,5.08 36.83,3.81 JP1.2
  Bottom 0.305: v6.35,31.75 6.35,53.34 R60.1
OPFILTER_IN2
  Top 0.305: C29.- 76.2,19.05 R55.2 73.66,12.7 C31.2 72.39,8.89 72.39,6.35 69.85,3.81 JP1.15
OPFILTER_OUT  (via drill 0.35)
  Top 0.305: C18.2 5.08,38.1 6.35,36.83 IC1.6 IC1.7 11.43,33.02 13.97,33.02 15.24,31.75 22.86,31.75 R58.1 25.53,31.62 v41.02,31.62 | v41.53,52.37 41.53,52.96 44.45,55.88 JP2.5
  Bottom 0.305: v41.02,31.62 41.02,42.29 41.53,42.8 v41.53,52.37
OPFILTER_OUT_SCALE
  Top 0.305: R25.1 71.12,53.34 69.85,54.61 JP2.15
RETURN
  Top 0.305: R24.1 76.2,54.61 73.66,54.61 72.39,55.88 JP2.16
RPTS_CV
  Top 0.305: R28.2 83.19,54.48 78.87,54.48 77.47,55.88 JP2.18
RPTS_LVL
  Top 0.305: R29.2 86.61,54.36 85.85,55.12 80.77,55.12 80.01,55.88 JP2.19
RSPEED  (via drill 0.35)
  Top 0.305: v50.16,28.07 50.16,18.41 49.53,17.78 41.91,17.78 R46.2
  Bottom 0.305: v50.16,28.07 50.16,31.62 52.2,33.66 Q2.1
SEND  (via drill 0.35)
  Top 0.305: IC1.8 20.32,34.29 R59.2 | JP1.4 41.91,3.81 40.64,5.08 38.1,5.08 35.56,7.62 17.78,7.62 11.43,13.97 11.43,24.13 15.24,27.94 v21.59,27.94
  Bottom 0.305: v21.59,27.94 R59.2
WET
  Top 0.305: JP1.19 80.01,3.81 81.28,5.08 97.79,5.08 IC6.9
  Bottom 0.305: R45.2 102.87,7.62 101.6,8.89 IC6.9
WET2
  Top 0.152: C7.1 39.37,54.36
  Top 0.305: C8.1 C7.1 | 39.37,54.36 JP2.3
WET_CV
  Top 0.305: R37.2 105.92,53.85 104.27,55.5 97.66,55.5 94.23,52.07 68.07,52.07 64.77,55.37 JP2.13
WET_LVL
  Top 0.305: R38.2 102.74,54.74 98.3,54.74 95,51.44 66.67,51.44 62.23,55.88 JP2.12
WET_OUT  (via drill 0.35)
  Top 0.305: R19.1 35.56,34.29 IC2.7 38.1,34.29 40.64,36.83 v40.64,44.45 | v40.64,49.53 40.64,50.16 41.91,51.44 52.29,51.44 53.29,52.43 53.29,54.18 54.61,55.5 JP2.9
  Bottom 0.305: v40.64,44.45 v40.64,49.53

### Text on the board
tPlace: encore! | m0xpd | v 2.0 June 2023 | Published under CC BY-SA License
bPlace: JLCJLCJLCJLC